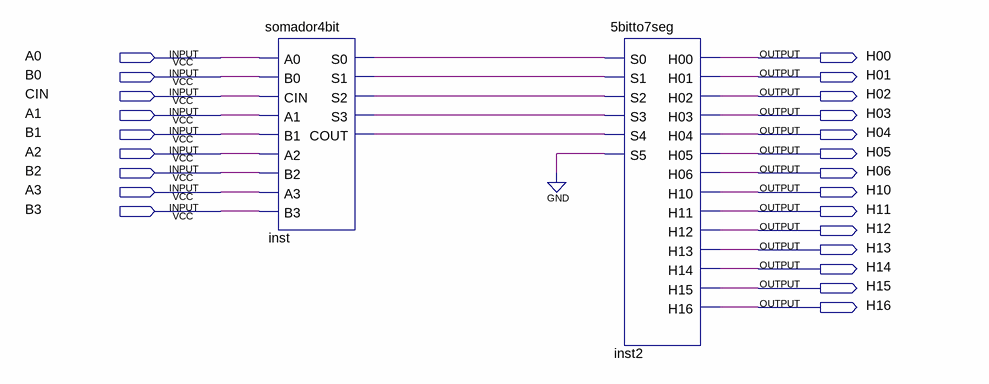
[diagram p0: schematic sheet]
// Quartus schematic somador4bit_5bitto7seg.bdf as structural Verilog: 2 symbols, 23 pins
module somador4bit_5bitto7seg (
  input  A0,
  input  B0,
  input  CIN,
  input  A1,
  input  B1,
  input  A2,
  input  B2,
  input  A3,
  input  B3,
  output H00,
  output H01,
  output H02,
  output H03,
  output H04,
  output H05,
  output H06,
  output H10,
  output H11,
  output H12,
  output H13,
  output H14,
  output H15,
  output H16
);

  wire inst_cout, inst_s0, inst_s1, inst_s2, inst_s3;

  somador4bit inst (
    .A0(A0), .B0(B0), .CIN(CIN), .A1(A1), .B1(B1), .A2(A2), .B2(B2), .A3(A3), .B3(B3), .S0(inst_s0),
    .S1(inst_s1), .S2(inst_s2), .S3(inst_s3), .COUT(inst_cout));
  \5bitto7seg  inst2 (
    .S0(inst_s0), .S1(inst_s1), .S2(inst_s2), .S3(inst_s3), .S4(inst_cout), .S5(1'b0), .H00(H00), .H01(H01),
    .H02(H02), .H03(H03), .H04(H04), .H05(H05), .H06(H06), .H10(H10), .H11(H11), .H12(H12), .H13(H13),
    .H14(H14), .H15(H15), .H16(H16));
endmodule
